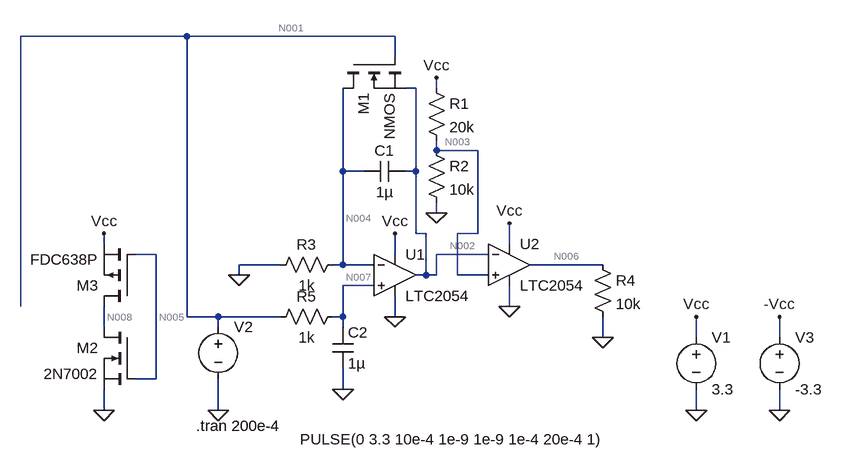
[diagram p0: schematic LineControlCircuit.asc]
LineControlCircuit.asc, the LTspice schematic file:
Version 4
SHEET 1 880 680
WIRE -240 -256 -496 -256
WIRE 80 -256 -240 -256
WIRE 80 -224 80 -256
WIRE 112 -176 96 -176
WIRE 144 -176 144 -192
WIRE 144 -80 144 -96
WIRE 208 -80 144 -80
WIRE 0 -48 0 -176
WIRE 32 -48 0 -48
WIRE 112 -48 112 -176
WIRE 112 -48 96 -48
WIRE 144 16 144 0
WIRE 112 48 112 -48
WIRE 128 48 112 48
WIRE 208 48 208 -80
WIRE 208 48 176 48
WIRE -368 64 -368 48
WIRE 256 64 256 32
WIRE -288 80 -320 80
WIRE 80 80 80 48
WIRE 224 80 144 80
WIRE -96 96 -160 96
WIRE 0 96 0 -48
WIRE 0 96 -16 96
WIRE 48 96 0 96
WIRE 400 96 288 96
WIRE -160 112 -160 96
WIRE 128 112 128 48
WIRE 128 112 112 112
WIRE 144 112 144 80
WIRE 144 112 128 112
WIRE 176 112 176 48
WIRE 224 112 176 112
WIRE 48 128 0 128
WIRE -496 160 -496 -256
WIRE 256 160 256 128
WIRE -240 176 -240 -256
WIRE -192 176 -240 176
WIRE -96 176 -192 176
WIRE 0 176 0 128
WIRE 0 176 -16 176
WIRE 80 176 80 144
WIRE -368 192 -368 160
WIRE -192 192 -192 176
WIRE 0 192 0 176
WIRE 400 208 400 176
WIRE 544 208 544 176
WIRE 672 208 672 176
WIRE -288 272 -288 80
WIRE -288 272 -320 272
WIRE 0 288 0 256
WIRE -368 320 -368 288
WIRE -192 320 -192 272
WIRE 544 320 544 288
WIRE 672 320 672 288
FLAG 544 176 Vcc
FLAG 544 320 0
FLAG 80 48 Vcc
FLAG 256 32 Vcc
FLAG 144 16 0
FLAG 144 -192 Vcc
FLAG 400 208 0
FLAG -192 320 0
FLAG 672 320 0
FLAG 672 176 -Vcc
FLAG -160 112 0
FLAG 0 288 0
FLAG 256 160 0
FLAG 80 176 0
FLAG -368 320 0
FLAG -368 48 Vcc
SYMBOL Opamps\\LTC2054 80 112 R0
SYMATTR InstName U1
SYMBOL Opamps\\LTC2054 256 96 R0
SYMATTR InstName U2
SYMBOL res 128 -192 R0
SYMATTR InstName R1
SYMATTR Value 20k
SYMBOL res 128 -96 R0
SYMATTR InstName R2
SYMATTR Value 10k
SYMBOL voltage 544 192 R0
SYMATTR InstName V1
SYMATTR Value 3.3
SYMBOL cap 32 -64 M90
WINDOW 0 0 32 VBottom 2
WINDOW 3 32 32 VTop 2
SYMATTR InstName C1
SYMATTR Value 1µ
SYMBOL res 0 80 R90
WINDOW 0 0 56 VBottom 2
WINDOW 3 32 56 VTop 2
SYMATTR InstName R3
SYMATTR Value 1k
SYMBOL res 384 80 R0
SYMATTR InstName R4
SYMATTR Value 10k
SYMBOL voltage -192 176 R0
WINDOW 3 126 189 Left 2
WINDOW 123 0 0 Left 2
WINDOW 39 0 0 Left 2
SYMATTR InstName V2
SYMATTR Value PULSE(0 3.3 10e-4 1e-9 1e-9 1e-4 20e-4 1)
SYMBOL voltage 672 192 R0
SYMATTR InstName V3
SYMATTR Value -3.3
SYMBOL res 0 160 R90
WINDOW 0 0 56 VBottom 2
WINDOW 3 32 56 VTop 2
SYMATTR InstName R5
SYMATTR Value 1k
SYMBOL cap -16 192 R0
SYMATTR InstName C2
SYMATTR Value 1µ
SYMBOL nmos 0 -224 M90
SYMATTR InstName M1
SYMBOL nmos -320 192 M0
SYMATTR InstName M2
SYMATTR Value 2N7002
SYMBOL pmos -320 160 R180
SYMATTR InstName M3
SYMATTR Value FDC638P
TEXT -226 344 Left 2 !.tran 200e-4

The netlist it stands for:
* LineControlCircuit.asc
XU1 N007 N004 N002 Vcc 0 LTC2054  ; pins In+ In- OUT V+ V-
XU2 N003 N002 N006 Vcc 0 LTC2054  ; pins In+ In- OUT V+ V-
R1 Vcc N003 20k
R2 N003 0 10k
V1 Vcc 0 3.3
C1 N004 N002 1µ
R3 N004 0 1k
R4 N006 0 10k
V2 N001 0 PULSE(0 3.3 10e-4 1e-9 1e-9 1e-4 20e-4 1)
V3 -Vcc 0 -3.3
R5 N007 N001 1k
C2 N007 0 1µ
M1 N004 N001 N002 N002 NMOS
M2 N008 N005 0 0 2N7002
M3 N008 N005 Vcc Vcc FDC638P
.model NMOS NMOS
.model PMOS PMOS
.lib standard.mos
.tran 200e-4
.lib LTC2.lib
.backanno
.end

* Results of the author's LTspice run, read from the files saved beside the schematic
* Operating Point, zero values left out:
*   V(vcc) = 3.3 V
*   V(n002) = 246.3 mV
*   V(n004) = 143.6 nV
*   V(n007) = 6.6 nV
*   V(n006) = 3.199 V
*   V(n003) = 1.1 V
*   V(-vcc) = -3.3 V
*   V(n008) = 3.3 V
*   Id(M1) = -137 pA
*   Ib(M1) = 136.7 pA
*   Id(M3) = -6.534 pA
*   Is(M3) = 6.534 pA
*   Id(M2) = 3.337 pA
*   Is(M2) = -3.337 pA
*   I(R5) = 6.6 pA
*   I(R4) = 319.9 µA
*   I(R3) = 143.6 pA
*   I(R2) = 110 µA
*   I(R1) = 110 µA
*   I(V2) = 6.6 pA
*   I(V1) = -658.7 µA
*   Ix(u1:1) = -6.6 pA
*   Ix(u1:2) = -6.6 pA
*   Ix(u1:3) = -131.4 pA
*   Ix(u1:4) = 114.7 µA
*   Ix(u1:5) = -114.7 µA
*   Ix(u2:1) = -2.2 pA
*   Ix(u2:2) = -5.615 pA
*   Ix(u2:3) = -319.9 µA
*   Ix(u2:4) = 434 µA
*   Ix(u2:5) = -114.1 µA
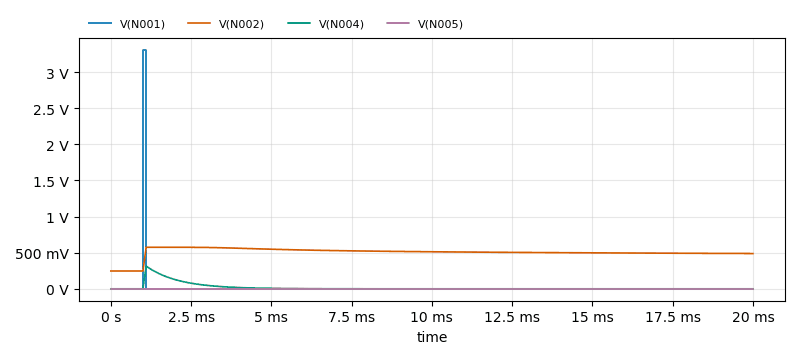
[diagram p1: Transient Analysis of LineControlCircuit.asc, plotted from the saved traces]
* Transient Analysis, 1 run:
*   V(N001): min 0 V, max 3.3 V, average 16.5 mV, rms 233.3 mV, last 0 V
*   V(N002): min 246.3 mV, max 574.9 mV, average 506 mV, rms 510.3 mV, last 488.2 mV
*   V(N004): min 143.6 nV, max 313.9 mV, average 16.53 mV, rms 51.54 mV, last 583.3 nV
*   V(N005): min -663.2 fV, max 328.4 fV, average -28.27 fV, rms 28.91 fV, last -30.07 fV